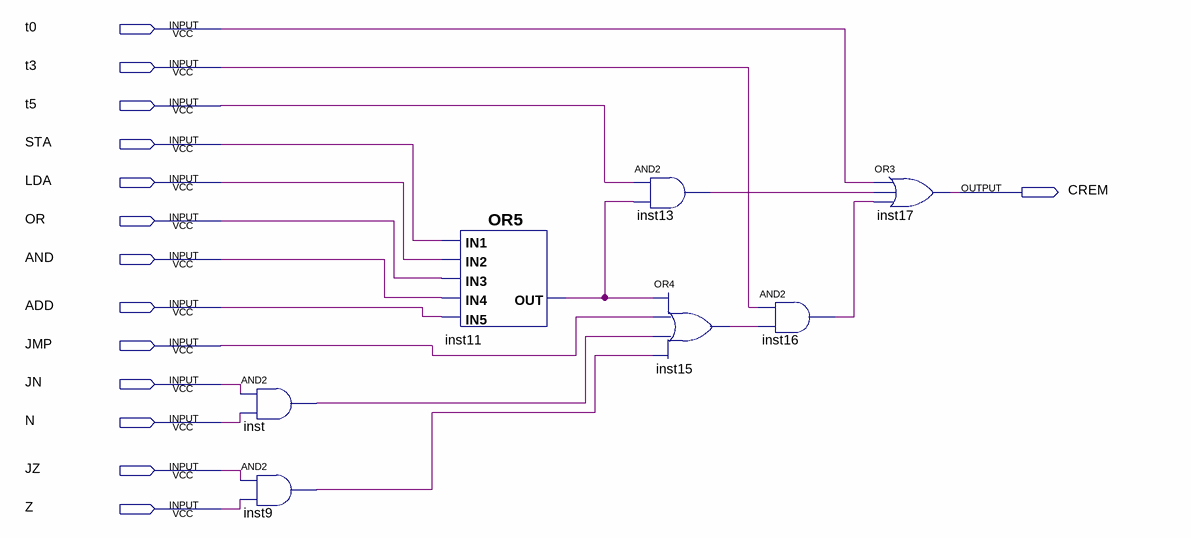
[diagram p0: schematic sheet]
// Quartus schematic CargaREM.bdf as structural Verilog: 7 symbols, 14 pins
module CargaREM (
  input  t0,
  input  t3,
  input  t5,
  input  STA,
  input  LDA,
  input  OR,
  input  AND,
  input  ADD,
  input  JMP,
  input  JN,
  input  N,
  input  JZ,
  input  Z,
  output CREM
);

  wire inst9_out, inst11_out, inst13_out, inst15_out, inst16_out, inst_out;

  and inst (inst_out, JN, N);
  and inst9 (inst9_out, JZ, Z);
  or inst11 (inst11_out, STA, LDA, OR, AND, ADD);
  and inst13 (inst13_out, t5, inst11_out);
  or inst15 (inst15_out, inst11_out, JMP, inst_out, inst9_out);
  and inst16 (inst16_out, t3, inst15_out);
  or inst17 (CREM, t0, inst13_out, inst16_out);
endmodule
